# Altium schematic sheet MCU.SchDoc
size A4; SheetNumber: 1; SheetTotal: 1
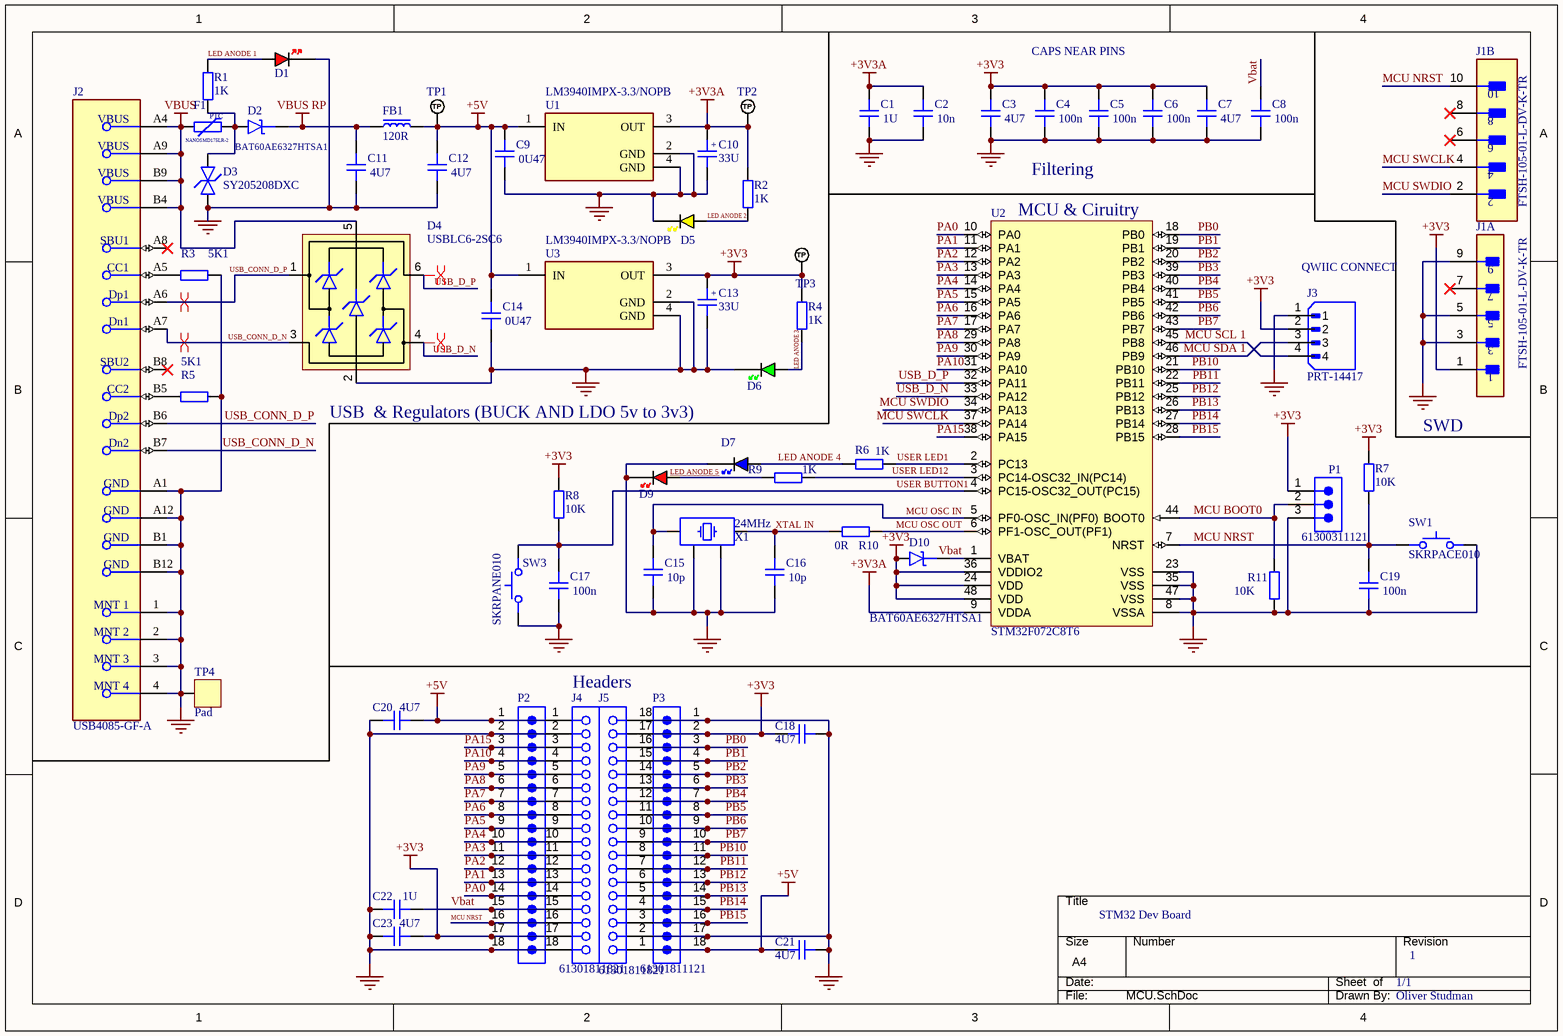
[diagram p0: MCU.SchDoc]

## Parts
C1  1U  [CAP_0603]
C2  10n  [CAP_0603]
C3  4U7  [CAP_0603]
C4  100n  [CAP_0603]
C5  100n  [CAP_0603]
C6  100n  [CAP_0603]
C7  4U7  [CAP_0603]
C8  100n  [CAP_0603]
C9  0U47  [CAP_0603]
C10  33U  [CAP_TANT_0603]
C11  4U7  [CAP_0603]
C12  4U7  [CAP_0603]
C13  33U  [CAP_TANT_0603]
C14  0U47  [CAP_0603]
C15  10p  [CAP_0603]
C16  10p  [CAP_0603]
C17  100n  [CAP_0603]
C18  4U7  [CAP_0603]
C19  100n  [CAP_0603]
C20  4U7  [CAP_0603]
C21  4U7  [CAP_0603]
C22  1U  [CAP_0603]
C23  4U7  [CAP_0603]
D1  RED  [LED_0603_RED]  (value not drawn)
D2  BAT60AE6327HTSA1  [SOD-323]
D3  SY205208DXC  [D_0603]
D4  USBLC6-2SC6  [SOT-23-6]
D5  YELLOW  [LED_0603_YELLOW]  (value not drawn)
D6  GREEN  [LED_0603_GREEN]  (value not drawn)
D7  BLUE  [LED_0603_BLUE]  (value not drawn)
D9  RED  [LED_0603_RED]  (value not drawn)
D10  BAT60AE6327HTSA1  [SOD-323]
F1  NANOSMD175LR-2  [FUSE_1206]
FB1  120R  [FB_0603]
J1  FTSH-105-01-L-DV-K-TR  [FP-FTSH-105-01-L-DV-K-TR-MFG]  (parts A,B of 2)
J2  USB4085-GF-A  [FP-USB4085-GF-A-MFG]
J3  PRT-14417  [SPARKFUN_PRT-14417]
J4  61301811821  [61301811821]
J5  61301811821  [61301811821]
P1  61300311121  [61300311121]
P2  61301811121  [61301811121]  (value not drawn)
P3  61301811121  [61301811121]
R1  1K  [RES_0603]
R2  1K  [RES_0603]
R3  5K1  [RES_0603]
R4  1K  [RES_0603]
R5  5K1  [RES_0603]
R6  1K  [RES_0603]
R7  10K  [RES_0603]
R8  10K  [RES_0603]
R9  1K  [RES_0603]
R10  0R  [RES_0603]
R11  10K  [RES_0603]
SW1  SKRPACE010  [SKRPANE010]
SW3  SKRPANE010  [SKRPANE010]
TP1  TP_NOBOM  [PAD_RND_1MM]  (value not drawn)  (no BOM)
TP2  TP_NOBOM  [PAD_RND_1MM]  (value not drawn)  (no BOM)
TP3  TP_NOBOM  [PAD_RND_1MM]  (value not drawn)  (no BOM)
TP4  Pad  [PAD_SQ_2MM]  (no BOM)
U1  LM3940IMPX-3.3/NOPB  [FP-DCY0004A-MFG]
U2  STM32F072C8T6  [STM-LQFP48_M]
U3  LM3940IMPX-3.3/NOPB  [FP-DCY0004A-MFG]
X1  24MHz  [XTAL_3225]

## Nets
+3V3: C3.2 C4.2 C5.2 C6.2 C7.2 C13.A C18.1 C23.1 D10.A J1.1 J3.2 J4.17 J5.17 P1.1 P2.17 P3.2 R4.2 R7.2 R8.2 TP3.1(TP) U2.24(VDD) U2.36(VDDIO2) U2.48(VDD) U3.3(OUT)
+3V3A: C1.2 C2.2 C10.A R2.2 TP2.1(TP) U1.3(OUT) U2.9(VDDA)
+5V: C9.2 C12.2 C14.2 C20.1 C21.1 FB1.2 J4.1 J5.1 P2.1 P3.18 TP1.1(TP) U1.1(IN) U3.1(IN)
GND: C1.1 C2.1 C3.1 C4.1 C5.1 C6.1 C7.1 C8.1 C9.1 C10.K C11.1 C12.1 C13.K C14.1 C15.1 C16.1 C17.1 C18.2 C19.1 C20.2 C21.2 C22.2 C23.2 D1.K D3.A D4.2(GND) D5.K D6.K D7.K D9.K J1.3 J1.5 J1.9 J2.1(MNT_1) J2.2(MNT_2) J2.3(MNT_3) J2.4(MNT_4) J2.A1(GND) J2.A12(GND) J2.B1(GND) J2.B12(GND) J3.1 J4.2 J4.18 J5.2 J5.18 P1.3 P2.2 P2.18 P3.1 P3.17 R3.2 R5.1 R11.1 SW1.34 SW3.12 TP4.1 U1.2(GND) U1.4(GND) U2.8(VSSA) U2.23(VSS) U2.35(VSS) U2.47(VSS) U3.2(GND) U3.4(GND) X1.2 X1.4
VBUS: D4.5(VBUS) F1.1 J2.A4(VBUS) J2.A9(VBUS) J2.B4(VBUS) J2.B9(VBUS)
VBUS RP: C11.2 D2.K FB1.1
LED ANODE 1: D1.A R1.2
LED ANODE 2: D5.A R2.1
LED ANODE 3: D6.A R4.1
LED ANODE 4: D7.A R6.1
LED ANODE 5: D9.A R9.1
MCU BOOT0: P1.2 R11.2 U2.44(BOOT0)
MCU NRST: C19.2 J1.10 J4.16 P2.16 R7.1 SW1.12 U2.7(NRST)
MCU OSC IN: C15.2 U2.5(PF0-OSC_IN(PF0)) X1.1
MCU OSC OUT: R10.1 U2.6(PF1-OSC_OUT(PF1))
MCU SCL 1: J3.4 U2.45(PB8)
MCU SDA 1: J3.3 U2.46(PB9)
MCU SWCLK: J1.4 U2.37(PA14)
MCU SWDIO: J1.2 U2.34(PA13)
PA0: J4.14 P2.14 U2.10(PA0)
PA1: J4.13 P2.13 U2.11(PA1)
PA2: J4.12 P2.12 U2.12(PA2)
PA3: J4.11 P2.11 U2.13(PA3)
PA4: J4.10 P2.10 U2.14(PA4)
PA5: J4.9 P2.9 U2.15(PA5)
PA6: J4.8 P2.8 U2.16(PA6)
PA7: J4.7 P2.7 U2.17(PA7)
PA8: J4.6 P2.6 U2.29(PA8)
PA9: J4.5 P2.5 U2.30(PA9)
PA10: J4.4 P2.4 U2.31(PA10)
PA15: J4.3 P2.3 U2.38(PA15)
PB0: J5.16 P3.3 U2.18(PB0)
PB1: J5.15 P3.4 U2.19(PB1)
PB2: J5.14 P3.5 U2.20(PB2)
PB3: J5.13 P3.6 U2.39(PB3)
PB4: J5.12 P3.7 U2.40(PB4)
PB5: J5.11 P3.8 U2.41(PB5)
PB6: J5.10 P3.9 U2.42(PB6)
PB7: J5.9 P3.10 U2.43(PB7)
PB10: J5.8 P3.11 U2.21(PB10)
PB11: J5.7 P3.12 U2.22(PB11)
PB12: J5.6 P3.13 U2.25(PB12)
PB13: J5.5 P3.14 U2.26(PB13)
PB14: J5.4 P3.15 U2.27(PB14)
PB15: J5.3 P3.16 U2.28(PB15)
USB_CONN_D_N: D4.3(IO2) J2.A7(Dn1) J2.B7(Dn2)
USB_CONN_D_P: D4.1(IO1) J2.A6(Dp1) J2.B6(Dp2)
USB_D_N: D4.4(IO2) U2.33(PA12)
USB_D_P: D4.6(IO1) U2.32(PA11)
USER BUTTON1: C17.2 R8.1 SW3.34 U2.4(PC15-OSC32_OUT(PC15))
USER LED1: R6.2 U2.2(PC13)
USER LED12: R9.2 U2.3(PC14-OSC32_IN(PC14))
Vbat: C8.2 C22.1 D10.K J4.15 P2.15 U2.1(VBAT)
XTAL IN: C16.2 R10.2 X1.3
NetD2_A: D2.A D3.K F1.2 R1.1
NetJ2_A5: J2.A5(CC1) R3.1
NetJ2_B5: J2.B5(CC2) R5.2

Not connected (* = marked no-connect by the designer): J1 6* 7* 8*; J2 A8(SBU1)* B8(SBU2)*

## Layout directives
differential pair: USB_CONN_D_N, USB_CONN_D_P, USB_D_N, USB_D_P

## Notes on the sheet
- CAPS NEAR PINS
- Filtering
- (near U2) MCU & Ciruitry
- (near J3) QWIIC CONNECT
- USB  & Regulators (BUCK AND LDO 5v to 3v3)
- SWD
- Headers
- STM32 Dev Board
- 1/1
- 1
- Oliver Studman
- DWG. NO.
- REV.
- SHT.
- REVISION
- DESCRIPTION
- DATE
- APPROVED
- THIS DOCUMENT AND THE DATA DISCLOSED HEREIN OR HEREWITH IS THE PROPERTY OF ALTIUM LIMITED AND MAY BE FREELY DISTRIBUTED IN WHOLE. NO RIGHTS ARE RESERVED OR EXPRESS OR IMPLIED WARANTEE GIVEN.
- ENG:
- DSN:
- APPROVALS
- PROJECT
- DOCUMENT REVISION:
- DESIGN ITEM:
- CHK:
- BOM:
- REFERENCE DOCUMENTS
- PROJECT REVISION:
- TITLE
- FAB DWG:
- PCB DWG:
- ASSY DWG:
- SCALE:
- SIZE
- C
- CAGE CODE
- FILE NAME
- DWG NO.
- SHEET
- OF
- REV
- (in symbol CAP_TANT_0603) +
- (in symbol FUSE_PPTC_1206) PTC

## Library data of the parts
C1-C9 C11 C12 C14-C23 = CAP_0603: Capacitor SMD 0603; Manufacturer: *; Manufacturer Part Number: *; Distributor Link: *; LCSC: *; Rating: *; Dielectric: *
C10 C13 = CAP_TANT_0603: Capacitor SMD Tantalum 0603; Manufacturer: *; Manufacturer Part Number: *; Distributor Link: *; LCSC: *
D1 D9 = LED_0603_RED: LED 0603 RED SMD
D2 D10 = D_SCHOTTKY_SOD_323: Diode Schottky SMD SOD-323
D3 = D_TVS_BI_0603: Diode TVS / ESD Bidirectional 0603; Manufacturer: *; Manufacturer Part Number: *
D4 = USBLC6-2SC6: Low-Capacitance ESD Protection USB; Manufacturer: STMicroelectronics; Manufacturer Part Number: USBLC6-2SC6; Distributor Link: https://www.mouser.de/ProductDetail/STMicroelectronics/USBLC6-2SC6?qs=po45yt2pPpu%2FhNIlwQdTlg%3D%3D
D5 = LED_0603_YELLOW: LED 0603 YELLOW SMD
D6 = LED_0603_GREEN: LED 0603 GREEN SMD
D7 = LED_0603_BLUE: LED 0603 BLUE SMD
F1 = FUSE_PPTC_1206: Fuse PPTC SMD 1206; Manufacturer: *; Manufacturer Part Number: *
FB1 = FB_0603: Ferrite Bead SMD 0603; Manufacturer: *; Manufacturer Part Number: *; Distributor Link: *; LCSC: *
J1 = CMP-2000-06293-2: CONN HEADER SMD 10POS 1.27MM; Max Current Rating: 1.75A; Number of Contacts: 10; Gender: Male; Row Spacing: 0.05inch; Connector Type: Male Pin; Housing Color: Black; Min Operating Temperature: -55°C; Depth: 3.43mm; Color: Black; Contact Plating: Gold; REACH SVHC: No SVHC; Packaging: Tape and Reel; Current Rating: 1.75A; Radiation Hardening: No; Package Quantity: 550; Number of Positions: 10; Max Operating Temperature: 125°C; Orientation: Straight; Termination: Solder; Contact Mating Length: 0.12inch; Number of Rows: 2; Lead Free: Lead Free; Contact Material: Bronze; Mount: Surface Mount; Housing Material: Polymer; Pitch: 1.27mm; Length: 6.35mm
J2 = CMP-196119-000001-2: CONN RCPT USB2.0 TYPE C 24POS RA; Gender: Receptacle; Number of Positions: 16; USB Standard: USB 2.0; Orientation: Right Angle; Contact Plating: Gold; Contact Material: Copper Alloy
J3 = CMP-002-00071-1: QWIIC JST CONNECTOR - SMD 4-PIN; MF: SparkFun Electronics; Component Type: Standard; Case/Package: None; MP: PRT-14417; Design Item ID: PRT-14417; Value: *; SnapEDA_Link: https://www.snapeda.com/parts/PRT-14417/SparkFun+Electronics/view-part/?ref=snap; Check_prices: https://www.snapeda.com/parts/PRT-14417/SparkFun+Electronics/view-part/?ref=eda; Pins: 4; Source: PRT-14417.SchLib
J4 J5 = CMP-1502-01346-3: NexarPartId: 61924740; Operating Supply Voltage: 250V; Current Rating: 3A; Contact Resistance: 20mΩ; Gender: Female; Lead Pitch: 2.54mm; Orientation: Vertical; RoHS: Non-Compliant; Number of Pins: 18
P1 = CMP-1502-01062-3: NexarPartId: 32855521; Current Rating: 3A; Voltage Rating: 250V; Number of Positions: 3; Pitch: 2.54mm; Contact Resistance: 20mΩ; Connector Type: Male Pin; Gender: Male; REACH SVHC: Unknown; Packaging: Bulk; Contact Material: Copper; Min Operating Temperature: -40°C; Number of Rows: 1; Orientation: Vertical; RoHS: Compliant; Contact Plating: Gold; Max Operating Temperature: 105°C; Mount: Through Hole; Height: 8.94mm; Operating Supply Voltage: 250V; Number of Pins: 3; Contact Mating Length: 5.9944mm; Number of Contacts: 3; Color: Black; Lead Free: Lead Free; Lead Pitch: 2.54mm; Termination: Solder
P2 P3 = CMP-1502-01099-4: NexarPartId: 32855552; Voltage Rating: 250V; Connector Type: Male Pin; Number of Contacts: 18; Current Rating: 3A; Gender: Male; Pitch: 2.54mm; Contact Resistance: 20mΩ; Lead Free: Lead Free; Color: Black; Number of Pins: 18; Number of Rows: 1; Operating Supply Voltage: 250V; Height: 8.89mm; Termination: Solder; Max Operating Temperature: 105°C; Contact Mating Length: 5.9944mm; Contact Material: Copper; Lead Pitch: 2.54mm; Min Operating Temperature: -40°C; Mount: Through Hole; Number of Positions: 18; Contact Plating: Gold; REACH SVHC: Unknown; Orientation: Vertical; RoHS: Compliant; Packaging: Bulk
R1-R11 = RES_0603: Resistor SMD 0603; Manufacturer: *; Manufacturer Part Number: *; Distributor Link: *; LCSC: *
SW1 SW3 = SKRPANE010: Tactile Switch SMD SPST; Manufacturer: Alps Alpine; Manufacturer Part Number: SKRPANE010
TP1-TP3 = TEST_POINT_RND_1MM: Test Point Round 1mm (NO BOM)
TP4 = PAD_SQ_2MM: Test Point Square 2mm
U1 U3 = CMP-04917-000180-1: IC REG LINEAR 3.3V 1A SOT223-4; Polarity: Positive; Dropout Voltage: 500mV; Number of Regulators: 1; Min Input Voltage: 4.5V; Quiescent Current: 15mA; Output Type: Fixed; Max Input Voltage: 7.5V; Packaging: Tape and Reel; Mount: Surface Mount; Number of Pins: 4; Package Quantity: 2000; Output Current: 1A; Min Operating Temperature: -40°C; Contact Plating: Tin; Max Output Current: 1A; Radiation Hardening: No; Output Voltage: 3.3V; Lead Free: Lead Free; Case/Package: SOT-223; Number of Outputs: 1; Max Operating Temperature: 125°C; RoHS Compliant: Yes
U2 = CMP-0304-00166-4: ARM Cortex-M0 32-bit MCU, 64 KB Flash, 16 KB Internal RAM, 37 I/Os, 48-Pin LQFP, -40 to 85 degC, Tray; Manufacturer: STMicroelectronics; Operating Frequency(F) (Processor speed) (MHz): 48; FLASH Size (Prog) (kB): 64; I/Os (High Current): 37; D/A Converter: 1; Internal RAM Size (kB): 16; Supply Voltage(Vcc) min (V): 2; Package Reference: LQFP48; DatasheetVersion: Rev. 5; Core: ARM Cortex-M0; ComponentLink1Description: Manufacturer URL; ComponentLink1URL: http://www.st.com/; Packing: Tray; Mounting Technology: Surface Mount; Package Description: 48-Pin Low Profile Quad Flat Package, Body 7 x 7 mm, Pitch 0.5 mm; ComponentLink2URL: http://www.st.com/st-web-ui/static/active/en/resource/technical/document/datasheet/DM00090510.pdf; ComponentLink2Description: Datasheet; PartNumber: STM32F072C8T6
X1 = TSX-3225_24.0000MF15X-AC: Crystal SMD 24MHz 10PPM 7pF 3225; Manufacturer: Epson; Manufacturer Part Number: TSX-3225 24.0000MF15X-AC